# Altium schematic sheet sumo.SchDoc
size A4
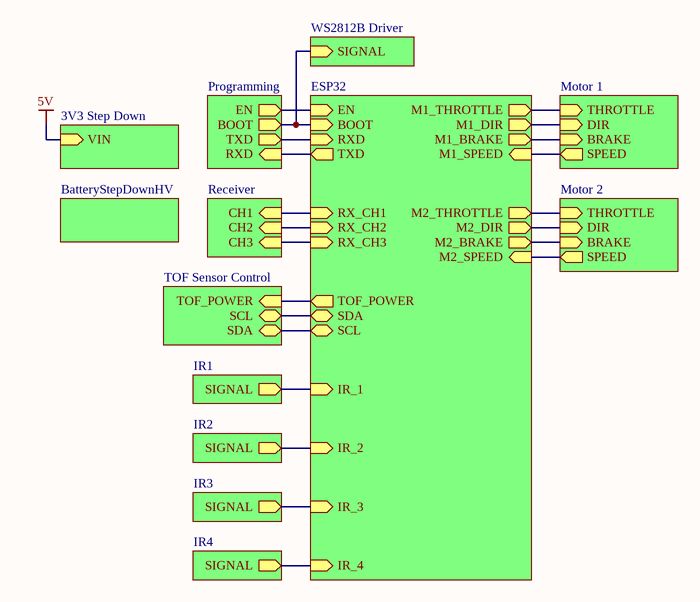
[diagram p0: sumo.SchDoc]

## Sub-sheets
3V3 Step Down = 3V3StepDown.SchDoc: VIN (in)
BatteryStepDownHV = BatteryStepDownHV.SchDoc: no entries
ESP32 = ESP32.SchDoc: EN (in), BOOT (in), RXD (in), TXD (out), M2_BRAKE (out), M1_BRAKE (out), M2_THROTTLE (out), M1_THROTTLE (out), RX_CH3 (in), M2_DIR (out), M1_DIR (out), RX_CH2 (in), RX_CH1 (in), IR_4 (in), IR_3 (in), IR_2 (in), IR_1 (in), SDA (bidir), SCL (bidir), TOF_POWER (out), M1_SPEED (in), M2_SPEED (in)
IR1 = IR.SchDoc: SIGNAL (out)
IR2 = IR.SchDoc: SIGNAL (out)
IR3 = IR.SchDoc: SIGNAL (out)
IR4 = IR.SchDoc: SIGNAL (out)
Motor 1 = MotorDriver.SchDoc: THROTTLE (in), DIR (in), BRAKE (in), SPEED (out)
Motor 2 = MotorDriver.SchDoc: THROTTLE (in), DIR (in), BRAKE (in), SPEED (out)
Programming = Programming.SchDoc: EN (out), BOOT (out), TXD (out), RXD (in)
Receiver = Receiver.SchDoc: CH1 (in), CH2 (in), CH3 (in)
TOF Sensor Control = TOFSensorControl.SchDoc: TOF_POWER (in), SCL (bidir), SDA (bidir)
WS2812B Driver = WS2812BDriver.SchDoc: SIGNAL (in)

## Nets
5V: sheet 3V3 Step Down/VIN
(unnamed): sheet ESP32/EN, sheet Programming/EN
(unnamed): sheet ESP32/BOOT, sheet Programming/BOOT, sheet WS2812B Driver/SIGNAL
(unnamed): sheet ESP32/RXD, sheet Programming/TXD
(unnamed): sheet ESP32/TXD, sheet Programming/RXD
(unnamed): sheet ESP32/M2_BRAKE, sheet Motor 2/BRAKE
(unnamed): sheet ESP32/M1_BRAKE, sheet Motor 1/BRAKE
(unnamed): sheet ESP32/M2_THROTTLE, sheet Motor 2/THROTTLE
(unnamed): sheet ESP32/M1_THROTTLE, sheet Motor 1/THROTTLE
(unnamed): sheet ESP32/RX_CH3, sheet Receiver/CH3
(unnamed): sheet ESP32/M2_DIR, sheet Motor 2/DIR
(unnamed): sheet ESP32/M1_DIR, sheet Motor 1/DIR
(unnamed): sheet ESP32/RX_CH2, sheet Receiver/CH2
(unnamed): sheet ESP32/RX_CH1, sheet Receiver/CH1
(unnamed): sheet ESP32/IR_4, sheet IR4/SIGNAL
(unnamed): sheet ESP32/IR_3, sheet IR3/SIGNAL
(unnamed): sheet ESP32/IR_2, sheet IR2/SIGNAL
(unnamed): sheet ESP32/IR_1, sheet IR1/SIGNAL
(unnamed): sheet ESP32/SDA, sheet TOF Sensor Control/SCL
(unnamed): sheet ESP32/SCL, sheet TOF Sensor Control/SDA
(unnamed): sheet ESP32/TOF_POWER, sheet TOF Sensor Control/TOF_POWER
(unnamed): sheet ESP32/M1_SPEED, sheet Motor 1/SPEED
(unnamed): sheet ESP32/M2_SPEED, sheet Motor 2/SPEED